# EAGLE design iow24my5 (EAGLE 5.09)
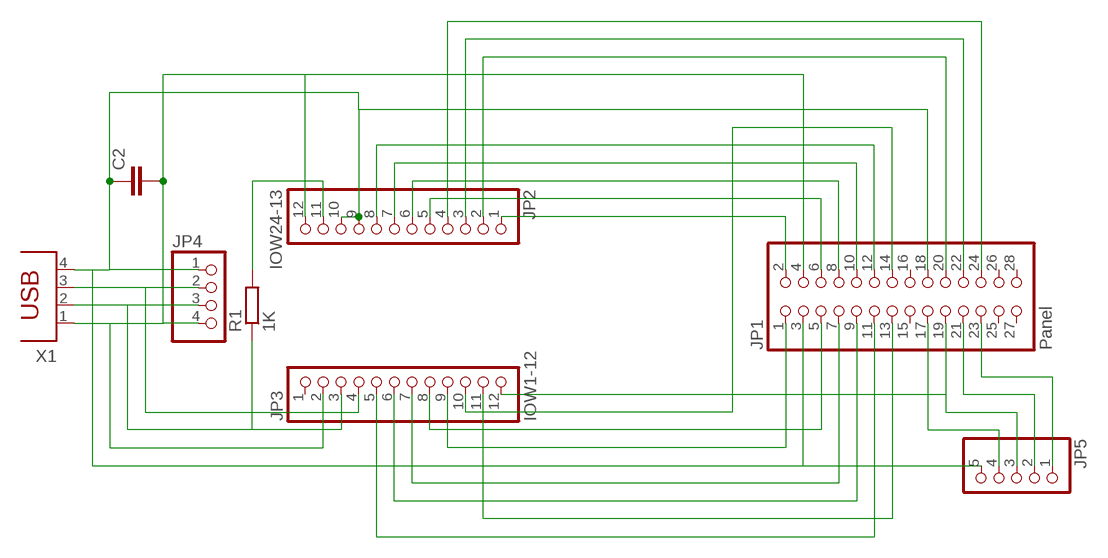
[diagram p0: schematic, sheet 1]

## Parts
C2  C2.5/2  [C2.5-2]
JP1  Panel  PINHD-2X14  [2X14]
JP2  IOW24-13  PINHD-1X12  [1X12]
JP3  IOW1-12  PINHD-1X12  [1X12]
JP4  PINHD-1X4  [1X04]
JP5  PINHD-1X5  [1X05]
R1  1K  R-EU_0204/2V  [0204V]
X1  PN61729  [PN61729]

## Nets
N$1: C2.2 JP1.4 JP2.12 JP3.2 JP4.4 X1.1
N$2: JP3.3 JP4.3 R1.1 X1.2
N$3: JP3.4 JP4.2 X1.3
N$4: C2.1 JP1.3 JP1.18 JP2.9 JP2.10 JP4.1 JP5.5 X1.4
N$5: JP2.11 R1.2
N$6: JP1.1 JP3.9
N$7: JP1.2 JP2.1
N$8: JP1.5 JP3.8
N$9: JP1.6 JP2.5
N$10: JP1.7 JP3.7
N$11: JP1.8 JP2.6
N$12: JP1.9 JP3.6
N$13: JP1.10 JP2.7
N$15: JP1.12 JP2.8
N$16: JP1.13 JP3.11
N$17: JP1.14 JP3.10
N$18: JP1.11 JP3.5
N$19: JP1.17 JP5.4
N$20: JP1.19 JP3.12 JP5.3
N$21: JP1.21 JP5.2
N$22: JP1.23 JP5.1
N$23: JP1.24 JP2.4
N$24: JP1.22 JP2.3
N$25: JP1.20 JP2.2
Unconnected: JP1.15 JP1.16 JP1.25 JP1.26 JP1.27 JP1.28 JP3.1

## Library data of the parts
C2 = capacitor-wima:C: CAPACITOR naming: grid - package width
JP1 = pinhead:PINHD-2X14: PIN HEADER
JP2 JP3 = pinhead:PINHD-1X12: PIN HEADER
JP4 = pinhead:PINHD-1X4: PIN HEADER
JP5 = pinhead:PINHD-1X5: PIN HEADER
R1 = resistor:R-EU_: RESISTOR, European symbol
X1 = con-berg:PN61729: BERG USB connector

## Board
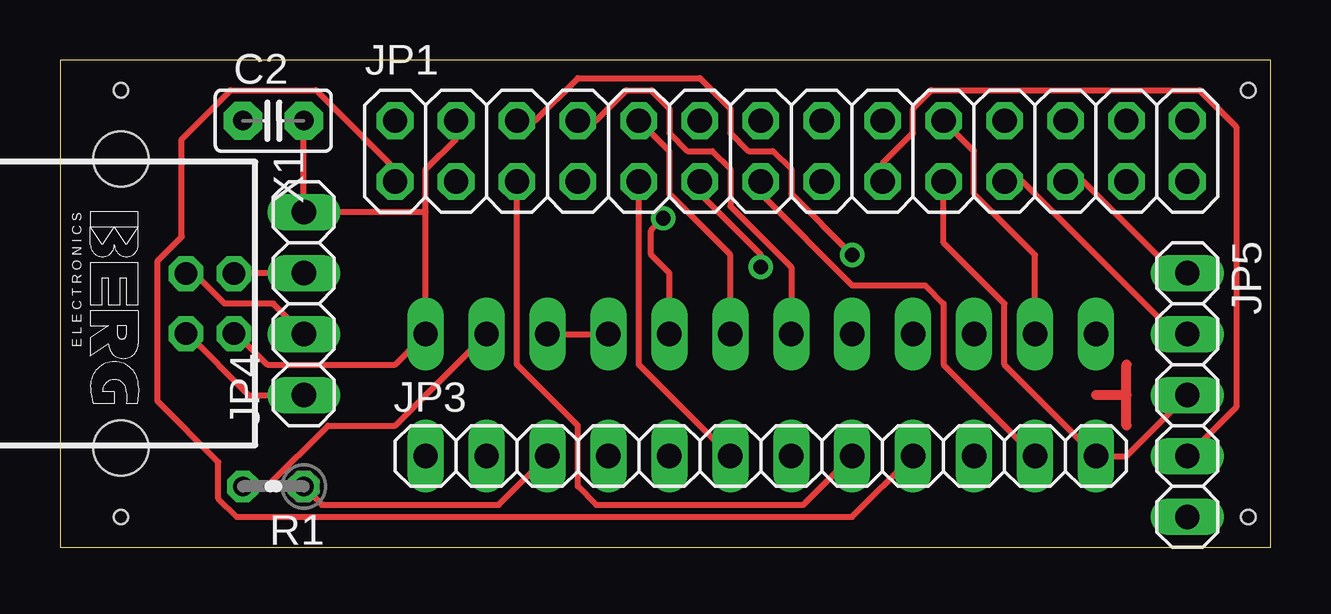
[diagram p1: board, top side]
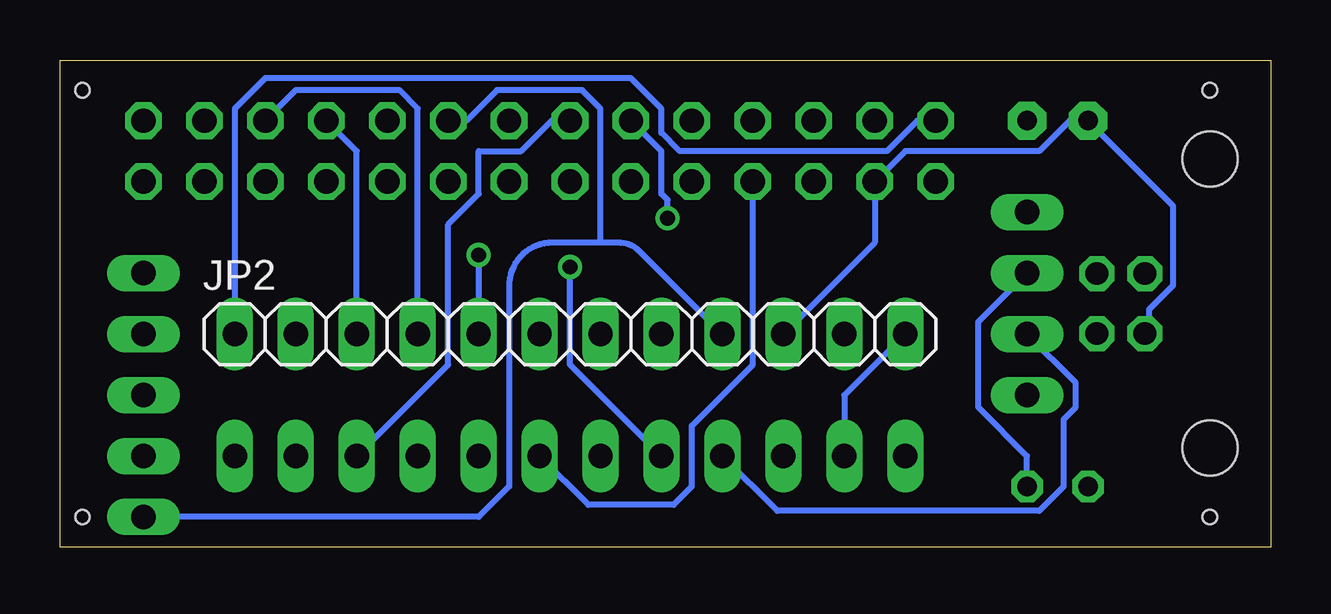
[diagram p2: board, bottom side, seen from below]

Size 50.47 x 20.31 mm. Coordinates in mm from the lower left corner, seen from the top.
Outline: 0,0 50.47,0 50.47,20.31 0,20.31 0,0
Copper layers (1*16): Top 0.035mm / dielectric 1.5mm / Bottom 0.035mm
Design rules "default": minimum track width 10mil, minimum drill 24mil, track to track 8mil, track to pad 8mil, pad to pad 8mil, via to via 8mil, smd to smd 8mil, copper to edge 40mil, drill to drill 8mil, minimum pad ring 10mil, minimum via ring 8mil, stop-mask expansion 4mil, vias tented up to drill 0mil, thermal gap 10mil
Holes 0.6 mm at 2.54,1.27 2.54,19.05 49.53,19.05 49.53,1.27

### Footprints (pad centres in the part's own frame; a part is rotated, then mirrored left to right if it is on the bottom)
C2.5-2 = drill 0.813 pad 1.6 octagon: 1 -1.27,0; 2 1.27,0
2X14 = drill 1.016 octagon: 1 -16.51,-1.27; 2 -16.51,1.27; 3 -13.97,-1.27; 4 -13.97,1.27; 5 -11.43,-1.27; 6 -11.43,1.27; 7 -8.89,-1.27; 8 -8.89,1.27; 9 -6.35,-1.27; 10 -6.35,1.27; 11 -3.81,-1.27; 12 -3.81,1.27; 13 -1.27,-1.27; 14 -1.27,1.27; 15 1.27,-1.27; 16 1.27,1.27; 17 3.81,-1.27; 18 3.81,1.27; 19 6.35,-1.27; 20 6.35,1.27; 21 8.89,-1.27; 22 8.89,1.27; 23 11.43,-1.27; 24 11.43,1.27; 25 13.97,-1.27; 26 13.97,1.27; 27 16.51,-1.27; 28 16.51,1.27
1X12 = drill 1.016 long: 1 -13.97,0; 2 -11.43,0; 3 -8.89,0; 4 -6.35,0; 5 -3.81,0; 6 -1.27,0; 7 1.27,0; 8 3.81,0; 9 6.35,0; 10 8.89,0; 11 11.43,0; 12 13.97,0
1X04 = drill 1.016 long: 1 -3.81,0; 2 -1.27,0; 3 1.27,0; 4 3.81,0
1X05 = drill 1.016 long: 1 -5.08,0; 2 -2.54,0; 3 0,0; 4 2.54,0; 5 5.08,0
0204V = drill 0.813 octagon: 1 -1.27,0; 2 1.27,0
PN61729 = drill 0.95 octagon: 1 1.25,4.71; 2 -1.25,4.71; 3 -1.25,2.71; 4 1.25,2.71 | hole 2.3: -6.02,0; 6.02,0

### Placement (x,y rotation side)
C2  8.89,17.78 0 top
JP1  30.48,16.51 0 top
JP2  29.21,8.89 0 bottom
JP3  29.21,3.81 0 top
JP4  10.16,10.16 90 top
JP5  46.99,6.35 270 top
R1  8.89,2.54 180 top
X1  2.54,10.16 270 top

### Tracks (layer width: path | path; a pad name or v marks a point on that pad's centre or on a via)
N$1
  Top 0.254: C2.2 JP4.4 15.24,13.97 | X1.1 7.37,8.89 8.64,7.62 13.97,7.62 JP2.12 15.24,13.97 | JP1.4 16.51,17.02 15.24,15.75 15.24,13.97
  Bottom 0.254: JP3.2 17.78,6.35 JP2.12
N$2
  Top 0.254: JP4.3 7.37,11.43 X1.2 | JP3.3 18.29,1.78 10.92,1.78 R1.1
  Bottom 0.254: R1.1 10.16,3.81 12.19,5.84 12.19,9.4 JP4.3
N$3
  Top 0.254: JP4.2 8.89,10.16 6.86,10.16 5.84,11.18 5.33,11.18 X1.3
  Bottom 0.254: JP3.4 20.57,1.52 9.65,1.52 8.64,2.54 8.64,5.33 8.13,5.84 8.13,6.86 JP4.2
N$4
  Top 0.254: JP4.1 7.87,6.35 5.33,8.89 X1.4 | JP2.10 JP2.9
  Bottom 0.254: JP2.10 16.51,12.7 JP1.3 15.24,16.51 9.65,16.51 8.38,17.78 C2.1 4.06,14.22 4.06,10.92 5.08,9.91 5.08,9.14 X1.4 | JP5.5 33.02,1.27 31.75,2.54 31.75,10.9 arc90 29.95,12.7 27.94,12.7 | JP2.9 26.3,12.33 arc-45 27.2,12.7 27.94,12.7 | JP1.18 33.53,17.78 32.26,19.05 28.7,19.05 27.94,18.29 27.94,12.7
N$5
  Top 0.254: R1.2 8.64,2.54 11.18,5.08 13.97,5.08 JP2.11
N$6
  Top 0.254: JP1.1 13.97,15.75 10.67,19.05 7.11,19.05 5.08,17.02 5.08,12.95 4.06,11.94 4.06,6.1 6.6,3.56 6.6,2.03 7.37,1.27 33.02,1.27 JP3.9
N$7
  Bottom 0.254: JP1.2 14.73,17.78 16,16.51 24.64,16.51 25.4,17.27 25.4,18.29 26.67,19.56 41.91,19.56 43.18,18.29 JP2.1
N$8
  Top 0.254: JP1.5 19.05,7.62 21.59,5.08 21.59,2.54 22.35,1.78 30.99,1.78 JP3.8
N$9  (via drill 0.61)
  Top 0.254: JP1.6 19.81,17.78 21.59,19.56 26.67,19.56 27.94,18.29 27.94,17.27 28.7,16.51 29.72,16.51 30.48,15.75 30.48,14.73 v33.02,12.19
  Bottom 0.254: v33.02,12.19 JP2.5
N$10
  Bottom 0.254: JP3.7 28.45,1.78 24.89,1.78 24.13,2.54 24.13,5.08 21.59,7.62 JP1.7
N$11
  Top 0.254: JP1.8 22.35,17.78 23.62,19.05 24.64,19.05 25.4,18.29 25.4,17.27 26.16,16.51 27.18,16.51 27.94,15.75 27.94,14.22 30.48,11.68 JP2.6
N$12
  Top 0.254: JP3.6 24.13,7.62 JP1.9
N$13
  Top 0.254: JP2.7 27.94,12.19 25.4,14.73 25.4,16.51 JP1.10
N$14
  Top 0.406: 44.45,6.35 44.45,7.62 | 44.45,5.08 44.45,6.35 | 44.45,6.35 43.18,6.35
N$15  (via drill 0.61)
  Top 0.254: JP2.8 25.4,11.43 24.64,12.19 24.64,13.21 v25.15,13.72
  Bottom 0.254: v25.15,13.72 25.15,14.48 25.4,14.73 25.4,16.51 JP1.12
N$16
  Top 0.254: JP1.13 29.21,14.73 33.02,10.92 36.07,10.92 36.83,10.16 36.83,7.62 JP3.11
N$17
  Bottom 0.254: JP3.10 34.29,7.62 34.29,13.46 33.02,14.73 33.02,16.51 31.24,16.51 29.97,17.78 JP1.14
N$18  (via drill 0.61)
  Top 0.254: v29.21,11.68 29.21,12.19 26.67,14.73 JP1.11
  Bottom 0.254: JP3.5 29.21,7.62 v29.21,11.68
N$19
  Top 0.254: JP1.17 34.29,16 35.56,17.27 35.56,18.29 36.32,19.05 47.5,19.05 49.02,17.53 49.02,5.84 JP5.4
N$20
  Top 0.254: JP5.3 44.45,3.81 JP3.12 39.37,7.62 39.37,10.16 36.83,12.7 JP1.19
N$21
  Top 0.254: JP1.21 40.13,15.24 46.48,8.89 JP5.2
N$22
  Top 0.254: JP1.23 42.67,15.24 46.48,11.43 JP5.1
N$23
  Bottom 0.254: JP2.4 35.56,18.29 36.32,19.05 40.64,19.05 JP1.24
N$24
  Bottom 0.254: JP2.3 38.1,16.51 JP1.22
N$25
  Top 0.254: JP2.2 40.64,12.19 38.1,14.73 38.1,16.51 JP1.20